# Altium project interface.PrjPcb
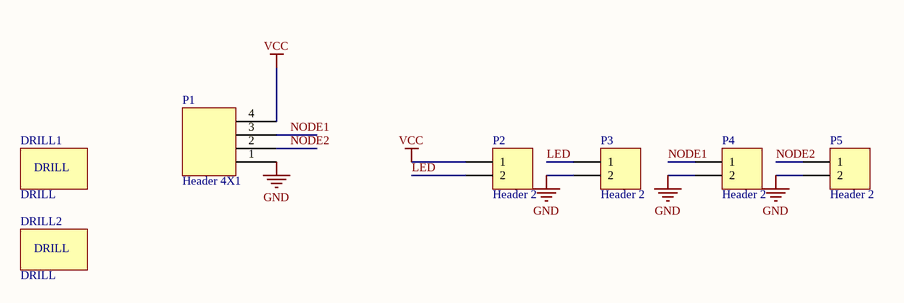
[diagram p0: interface.SchDoc]
1 sheet, 7 parts. Net scope: global (net labels, ports and power ports of the same name join across sheets).
Board file: interface.PcbDoc

## Sheet interface.SchDoc
size A4

### Parts
DRILL1  DRILL  [DRILL_2MM]
DRILL2  DRILL  [DRILL_2MM]
P1  Header 4X1  [HDR4X1]
P2  Header 2  [HDR1X2]
P3  Header 2  [HDR1X2]
P4  Header 2  [HDR1X2]
P5  Header 2  [HDR1X2]

### Nets
GND: P1.1 P3.2 P4.2 P5.2
VCC: P1.4 P2.1
LED: P2.2 P3.1
NODE1: P1.3 P4.1
NODE2: P1.2 P5.1

### Library data of the parts
P1 = Header 4X1: Header,4-Pin
P2-P5 = Header 2: Header, 2-Pin; LatestRevisionDate: 17-Jul-2002; LatestRevisionNote: Re-released for DXP Platform.; Publisher: Altium Limited